# EAGLE design 3v3_LM317 (EAGLE 5.04)
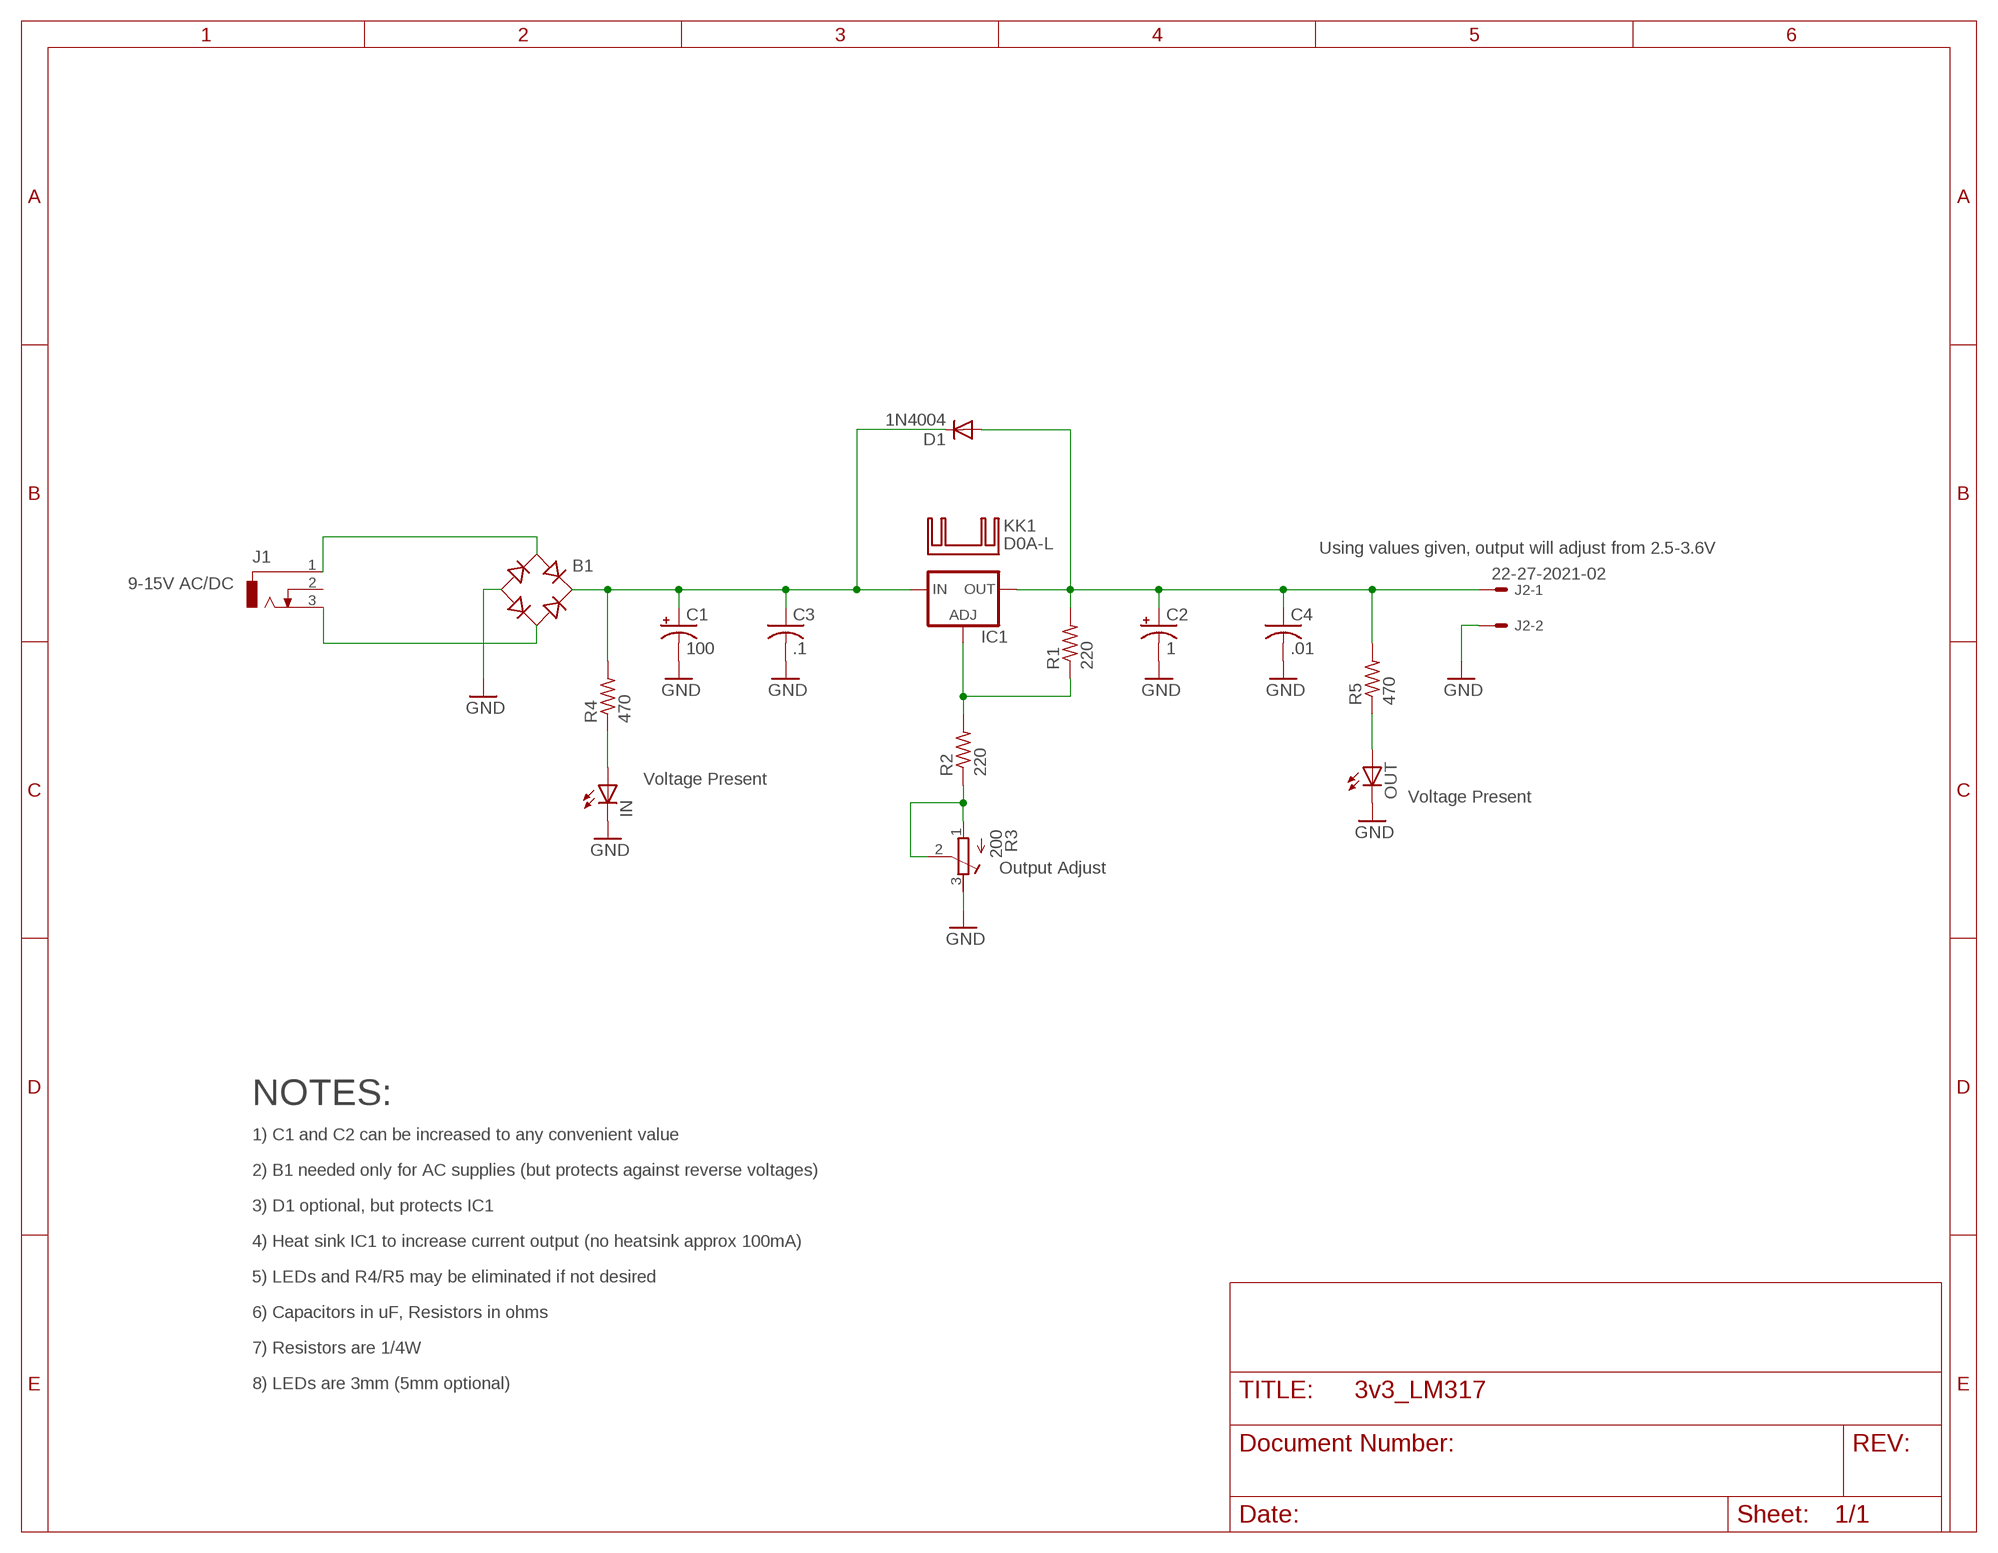
[diagram p0: schematic, sheet 1]

## Parts
B1  B-DIL  [B-DIL]
C1  100  CPOL-USE2.5-7  [E2,5-7]
C2  1  CPOL-USE2.5-7  [E2,5-7]
C3  .1  C-US025-025X050  [C025-025X050]
C4  .01  C-US025-025X050  [C025-025X050]
D1  1N4004  [DO41-10]
IC1  LM317TL  [317TL]
IN  LED3MM  [LED3MM]
J1  DCJ0303  [DCJ0303]
J2  22-27-2021-02  [6410-02]
KK1  D0A-L  [D02A-L]
OUT  LED3MM  [LED3MM]
R1  220  R-US_0204/7  [0204/7]
R2  220  R-US_0204/7  [0204/7]
R3  200  R-TRIMM64Y  [RTRIM64Y]
R4  470  R-US_0204/7  [0204/7]
R5  470  R-US_0204/7  [0204/7]

## Nets
GND: B1.- C1.- C2.- C3.2 C4.2 IN.K(C) J2.2 OUT.K(C) R3.3(A)
N$1: B1.AC1 J1.1
N$2: B1.AC2 J1.3
N$3: B1.+ C1.+ C3.1 D1.C IC1.3(IN) R4.2
N$4: C2.+ C4.1 D1.A IC1.2(OUT) J2.1 R1.2 R5.2
N$6: IC1.1(ADJ) R1.1 R2.2
N$7: R2.1 R3.1(E) R3.2(S)
N$11: IN.A R4.1
N$12: OUT.A R5.1
Unconnected: J1.2

## Notes on the sheet
- Using values given, output will adjust from 2.5-3.6V
- 9-15V AC/DC
- Voltage Present
- Voltage Present
- Output Adjust
- NOTES:
- 1) C1 and C2 can be increased to any convenient value
- 2) B1 needed only for AC supplies (but protects against reverse voltages)
- 3) D1 optional, but protects IC1
- 4) Heat sink IC1 to increase current output (no heatsink approx 100mA)
- 5) LEDs and R4/R5 may be eliminated if not desired
- 6) Capacitors in uF, Resistors in ohms
- 7) Resistors are 1/4W
- 8) LEDs are 3mm (5mm optional)

## Library data of the parts
B1 = rectifier:B-DIL: RECTIFIER
C1 C2 = rcl:CPOL-US: POLARIZED CAPACITOR, American symbol
C3 C4 = rcl:C-US: CAPACITOR, American symbol
D1 = diode:1N4004: DIODE general purpose rectifier, 1 A
IC1 = v-reg:LM317TL: VOLTAGE REGULATOR
IN OUT = led:LED: LED OSRAM: - CHIPLED LG R971, LG N971, LY N971, LG Q971, LY Q971, LO R971, LY R971 LH N974, LH R974 LS Q976, LO Q976, LY Q976 LO Q996 - Hyper CHIPLED LW Q18S LB Q993, LB Q99A, LB R99A - SideLED LS A670, LO A670, LY A670, LG A670, LP A670 LB A673, LV A673, LT A673, LW A673 LH A674 LY A675 LS A676, LA A676, LO A676, LY A676, LW A676 LS A679, LY A679, LG A679 - Hyper Micro SIDELED® LS Y876, LA Y876, LO Y876, LY Y876 LT Y87S - SmartLED LW L88C, LW L88S LB L89C, LB L89S, LG L890 LS L89K, LO L89K, LY L89K LS L896, LA L896, LO L896, LY L896 - TOPLED LS T670, LO T670, LY T670, LG T670, LP T670 LSG T670, LSP T670, LSY T670, LOP T670, LYG T670 LG T671, LOG T671, LSG T671 LB T673, LV T673, LT T673, LW T673 LH T674 LS T676, LA T676, LO T676, LY T676, LB T676, LH T676, LSB T676, LW T676 LB T67C, LV T67C, LT T67C, LS T67K, LO T67K, LY T67K, LW E67C LS E67B, LA E67B, LO E67B, LY E67B, LB E67C, LV E67C, LT E67C LW T67C LS T679, LY T679, LG T679 LS T770, LO T770, LY T770, LG T770, LP T770 LB T773, LV T773, LT T773, LW T773 LH T774 LS E675, LA E675, LY E675, LS T675 LS T776, LA T776, LO T776, LY T776, LB T776 LHGB T686 LT T68C, LB T68C - Hyper Mini TOPLED® LB M676 - Mini TOPLED Santana® LG M470 LS M47K, LO M47K, LY M47K Source: http://www.osram.convergy.de LUXEON: - LUMILED® LXK2-PW12-R00, LXK2-PW12-S00, LXK2-PW14-U00, LXK2-PW14-V00 LXK2-PM12-R00, LXK2-PM12-S00, LXK2-PM14-U00 LXK2-PE12-Q00, LXK2-PE12-R00, LXK2-PE12-S00, LXK2-PE14-T00, LXK2-PE14-U00 LXK2-PB12-K00, LXK2-PB12-L00, LXK2-PB12-M00, LXK2-PB14-N00, LXK2-PB14-P00, LXK2-PB14-Q00 LXK2-PR12-L00, LXK2-PR12-M00, LXK2-PR14-Q00, LXK2-PR14-R00 LXK2-PD12-Q00, LXK2-PD12-R00, LXK2-PD12-S00 LXK2-PH12-R00, LXK2-PH12-S00 LXK2-PL12-P00, LXK2-PL12-Q00, LXK2-PL12-R00 Source: www.luxeon.com KINGBRIGHT: KA-3528ASYC Source: www.kingbright.com
J1 = con-jack:DCJ0303: DC POWER JACK Source: DCJ0303.pdf
J2 = con-molex:22-?-02: CONNECTOR wire to board 2.54 mm (.1 inch) pitch header
KK1 = heatsink:D0A-L: HEATSINK distributor Schukat
R1 R2 R4 R5 = rcl:R-US_: RESISTOR, American symbol
R3 = rcl:R-TRIMM: Trimm resistor

## Board
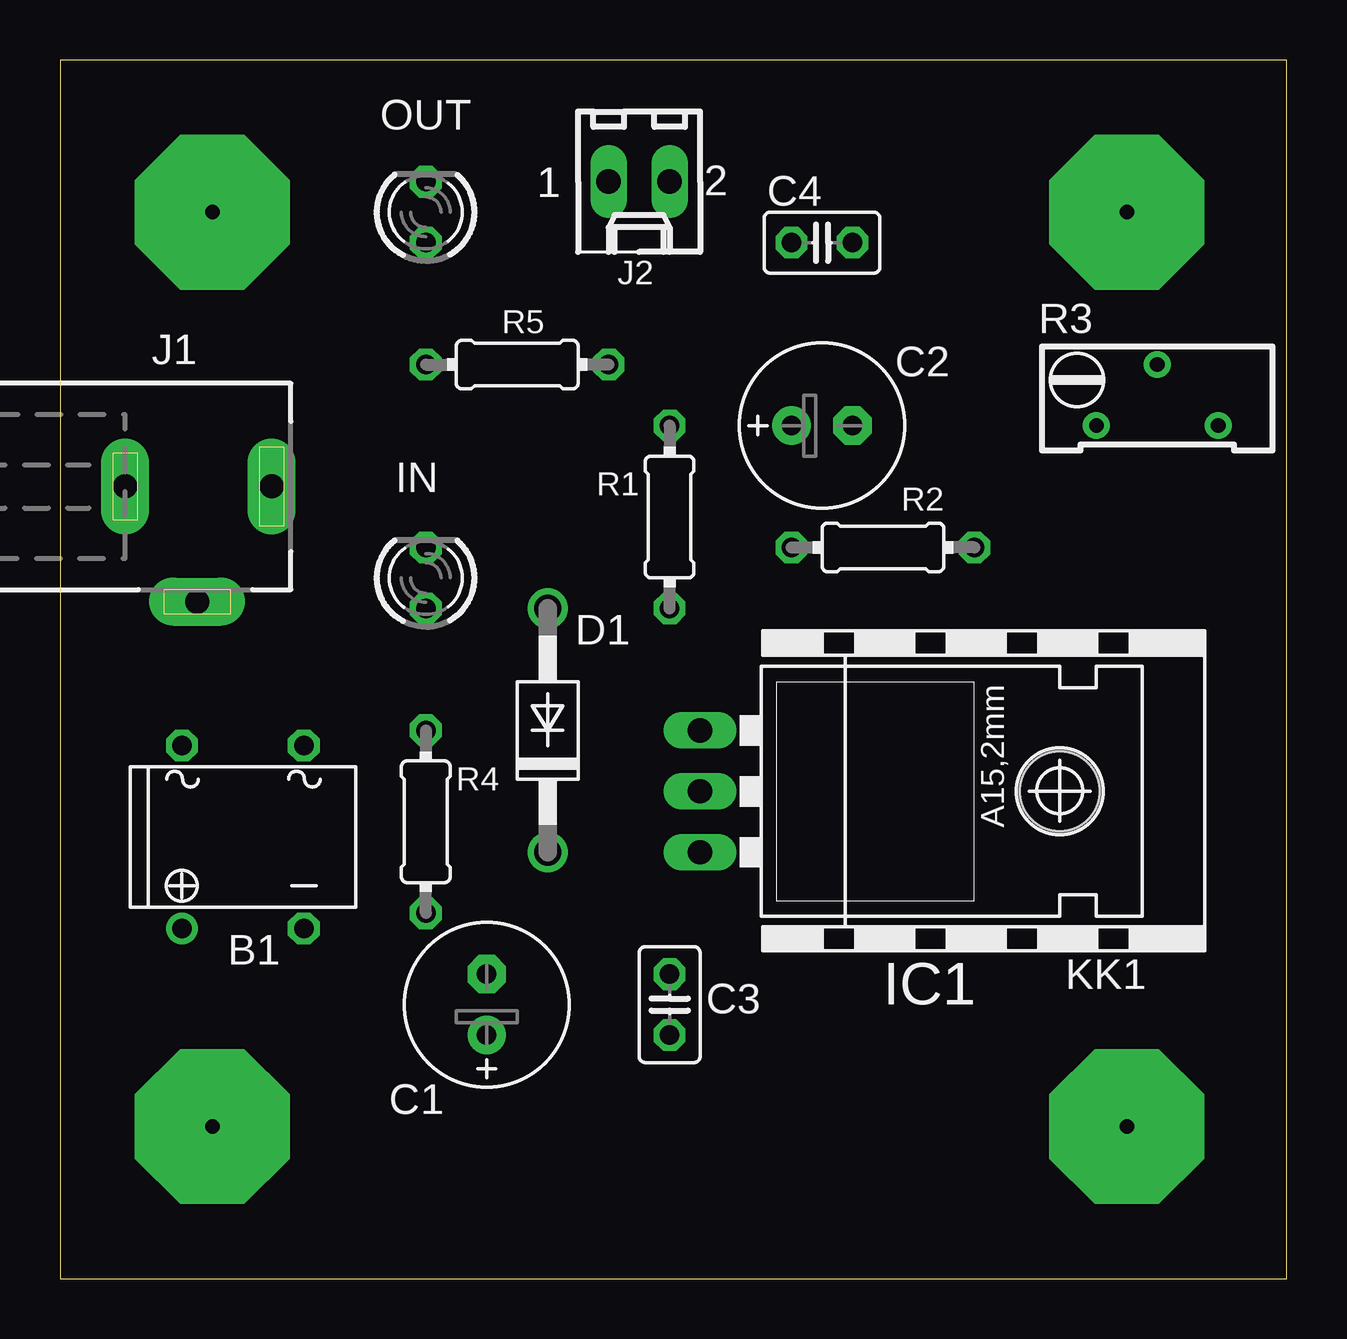
[diagram p1: board, top side]
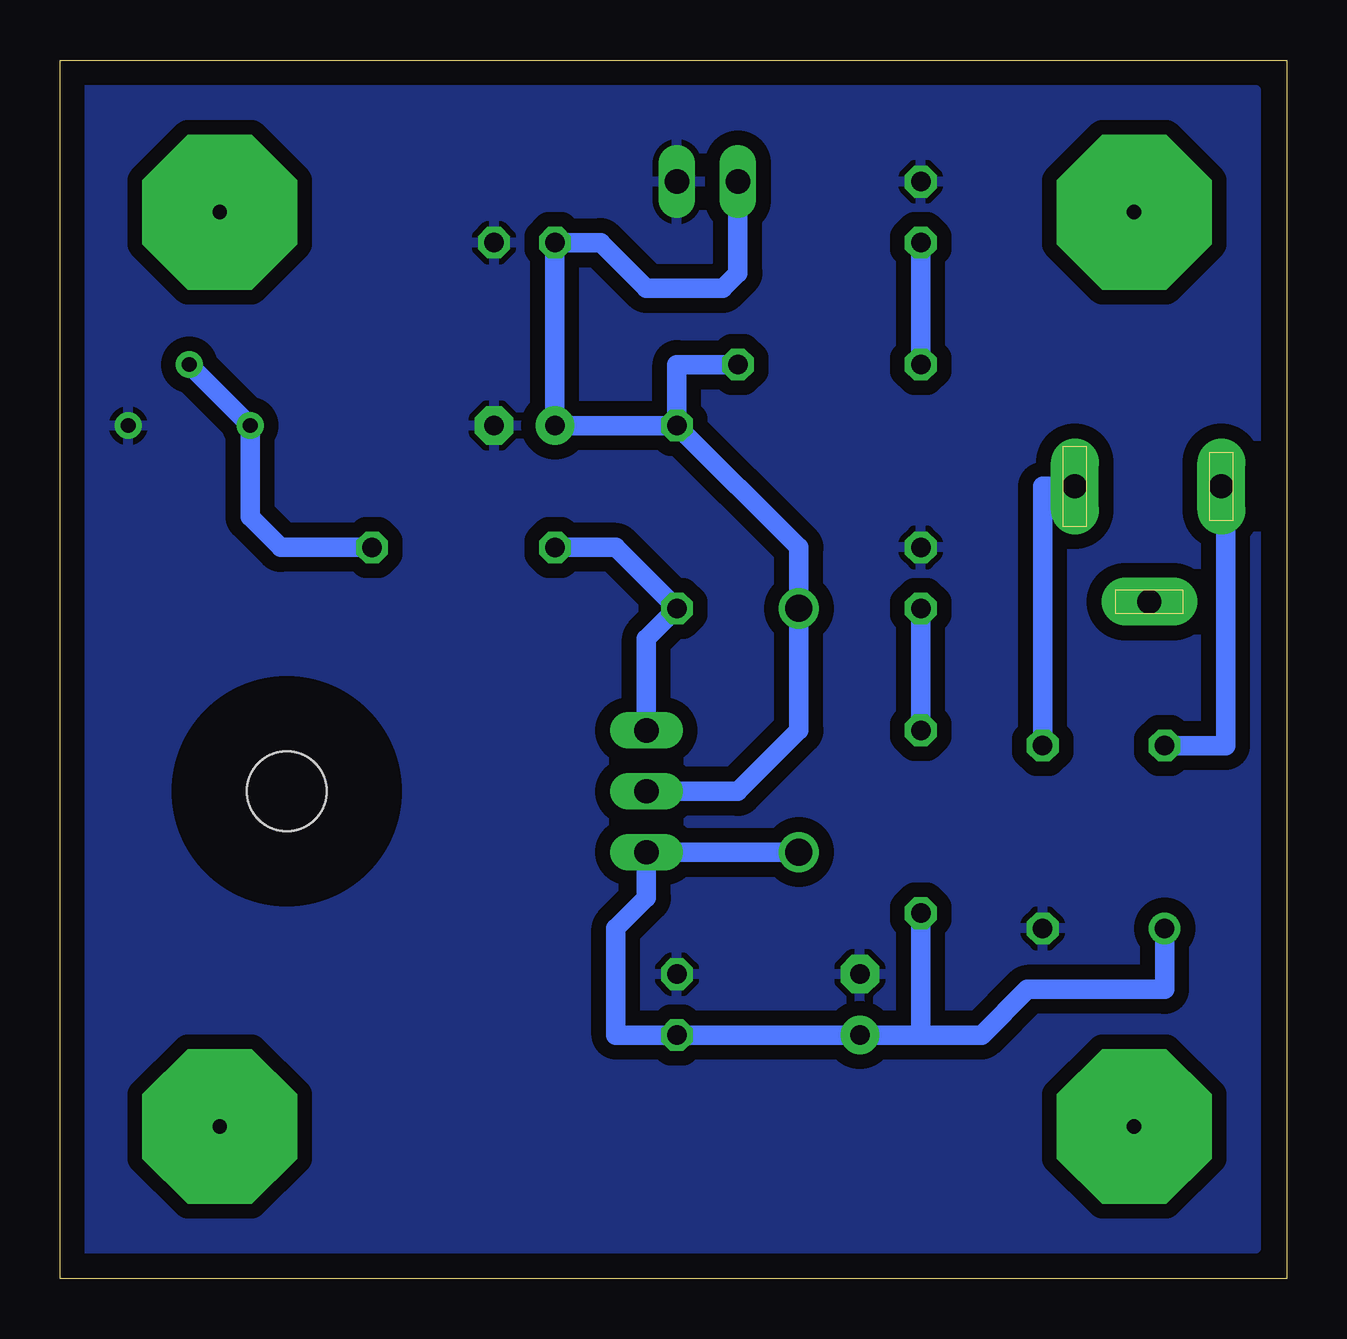
[diagram p2: board, bottom side, seen from below]

Size 51.1 x 50.79 mm. Coordinates in mm from the lower left corner, seen from the top.
Outline: 0,0 51.1,0 51.1,50.79 0,50.79 0,0
Copper layers (1*16): Top 0.035mm / dielectric 1.5mm / Bottom 0.035mm
Design rules "default": minimum track width 10mil, minimum drill 24mil, track to track 8mil, track to pad 8mil, pad to pad 8mil, via to via 8mil, smd to smd 8mil, copper to edge 40mil, drill to drill 8mil, minimum pad ring 10mil, minimum via ring 8mil, stop-mask expansion 4mil, vias tented up to drill 0mil, thermal gap 10mil

### Footprints (pad centres in the part's own frame; a part is rotated, then mirrored left to right if it is on the bottom)
B-DIL = drill 0.813 round: + -2.54,-3.81 | drill 0.813 octagon: - 2.54,-3.81; AC1 2.54,3.81; AC2 -2.54,3.81
E2,5-7 = drill 0.813 pad 1.6 round: + -1.27,0 | drill 0.813 pad 1.6 octagon: - 1.27,0
C025-025X050 = drill 0.813 octagon: 1 -1.27,0; 2 1.27,0
DO41-10 = drill 1.118 round: A 5.08,0; C -5.08,0
317TL = drill 1.016 long: 1 -2.54,-3.81; 2 0,-3.81; 3 2.54,-3.81 | hole 3.302: 0,11.176
LED3MM = drill 0.813 octagon: A -1.27,0; K 1.27,0
DCJ0303 = drill 1 pad 2 long: 1 0,3.1; 2 4.8,0; 3 0,-3
6410-02 = drill 1.016 long: 1 1.27,0; 2 -1.27,0
0204/7 = drill 0.813 octagon: 1 -3.81,0; 2 3.81,0
RTRIM64Y = drill 0.61 round: 1 0,-2.54; 2 -2.54,0; 3 0,2.54

### Placement (x,y rotation side)
B1  7.62,18.41 0 top
C1  17.78,11.43 90 top
C2  31.75,35.56 0 top
C3  25.4,11.43 90 top
C4  31.75,43.18 0 top
D1  20.32,22.86 90 top
IC1  30.48,20.32 270 top
IN  15.24,29.21 90 top
J1  5.71,33.02 270 top
J2  24.13,45.72 180 top
KK1  36.2,20.32 180 top
OUT  15.24,44.45 90 top
R1  25.4,31.75 90 top
R2  34.29,30.48 180 top
R3  45.72,35.56 270 top
R4  15.24,19.05 270 top
R5  19.05,38.1 0 top

### Tracks (layer width: path | path; a pad name or v marks a point on that pad's centre or on a via)
GND
  pour Bottom (isolate 0.61): 1.27,49.53 50.16,49.53 50.16,1.27 1.27,1.27
N$1
  Bottom 0.813: J1.1 10.16,33.02 B1.AC1
N$2
  Bottom 0.813: J1.3 2.54,33.02 2.54,22.23 B1.AC2
N$3
  Bottom 0.813: B1.+ 5.08,12.06 10.79,12.06 12.7,10.16 15.24,10.16 | 15.24,10.16 C1.+ C3.1 27.94,10.16 27.94,14.61 26.67,15.88 IC1.3 D1.C | 15.24,10.16 R4.2
N$4
  Bottom 0.813: IC1.2 22.86,20.32 20.32,22.86 D1.A 20.32,30.48 R1.2 | R1.2 C2.+ C4.1 28.57,43.18 26.67,41.27 23.5,41.27 22.86,41.91 J2.1 | R5.2 25.4,38.1 R1.2
N$5  (via drill 0.6 pad 6.45)
  other vias: 6.35,44.45
N$6
  Bottom 0.813: IC1.1 26.67,26.67 R1.1 27.94,30.48 R2.2
N$7
  Bottom 0.813: R2.1 41.91,30.48 43.18,31.75 R3.1 R3.2
N$8  (via drill 0.6 pad 6.45)
  other vias: 6.35,6.35
N$9  (via drill 0.6 pad 6.45)
  other vias: 44.45,6.35
N$10  (via drill 0.6 pad 6.45)
  other vias: 44.45,44.45
N$11
  Bottom 0.813: R4.1 IN.A
N$12
  Bottom 0.813: R5.1 OUT.A